# EAGLE design RGBIO8 (EAGLE 5.11)
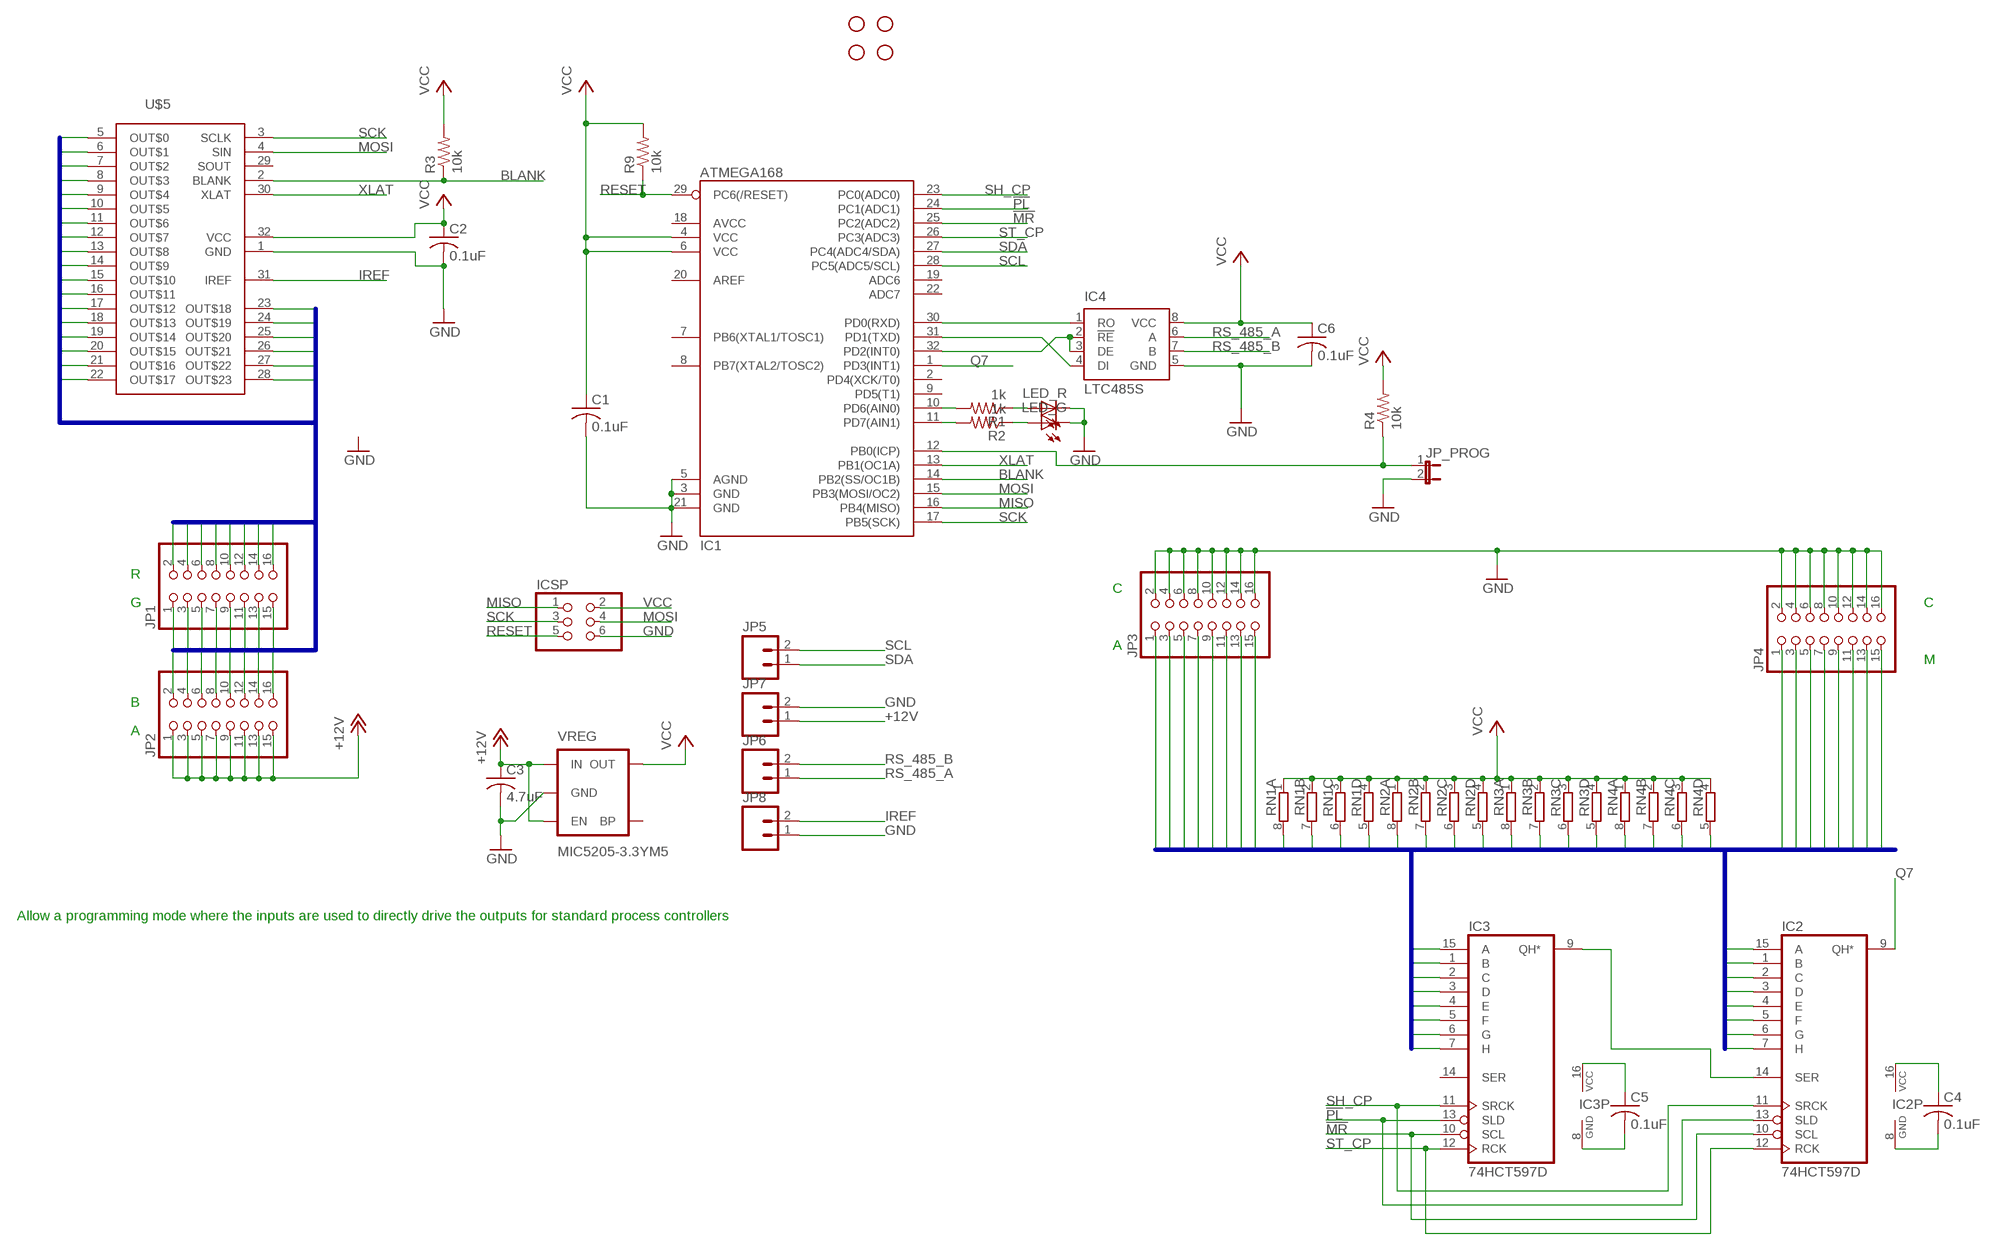
[diagram p0: schematic, sheet 1]

## Parts
C1  0.1uF  C-USC0603  [C0603]
C2  0.1uF  C-USC0603  [C0603]
C3  4.7uF  C-USC0603  [C0603]
C4  0.1uF  C-USC0603  [C0603]
C5  0.1uF  C-USC0603  [C0603]
C6  0.1uF  C-USC0603  [C0603]
IC1  ATMEGA168  [TQFP32-08]
IC2  74HCT597D  [SO16]
IC3  74HCT597D  [SO16]
IC4  LTC485S  [SOIC8]
ICSP  PINHD-2X3  [2X03]
JP1  PINHD-2X8  [2X08]
JP2  PINHD-2X8  [2X08]
JP3  PINHD-2X8  [2X08]
JP4  PINHD-2X8  [2X08]
JP5  M023.5MM  [SCREWTERMINAL-3.5MM-2]
JP6  M023.5MM  [SCREWTERMINAL-3.5MM-2]
JP7  M023.5MM  [SCREWTERMINAL-3.5MM-2]
JP8  M023.5MM  [SCREWTERMINAL-3.5MM-2]
JP_PROG  JUMPER-2PTH  [1X02]
LED_G  LEDCHIP-LED0603  [CHIP-LED0603]
LED_R  LEDCHIP-LED0603  [CHIP-LED0603]
R1  1k  R-US_R0603  [R0603]
R2  1k  R-US_R0603  [R0603]
R3  10k  R-US_R0603  [R0603]
R4  10k  R-US_R0603  [R0603]
R9  10k  R-US_R0603  [R0603]
RN1  4R-NEXBS8V  [EXBS8V]
RN2  4R-NEXBS8V  [EXBS8V]
RN3  4R-NEXBS8V  [EXBS8V]
RN4  4R-NEXBS8V  [EXBS8V]
U$1  STAND-OFF  [STAND-OFF]
U$2  STAND-OFF  [STAND-OFF]
U$3  STAND-OFF  [STAND-OFF]
U$4  STAND-OFF  [STAND-OFF]
U$5  TLC5947  [HTSSOP32DAP]
VREG  MIC5205-3.3YM5  V_REG_LDOSMD  [SOT23-5]

## Nets
!MR: IC1.25(PC2(ADC2)) IC2.10(SCL) IC3.10(SCL)
!PL: IC1.24(PC1(ADC1)) IC2.13(SLD) IC3.13(SLD)
+12V [Power]: C3.1 JP2.1 JP2.3 JP2.5 JP2.7 JP2.9 JP2.11 JP2.13 JP2.15 JP7.1 VREG.1(IN) VREG.3(EN)
BLANK: IC1.14(PB2(SS/OC1B)) R3.1 U$5.2(BLANK)
GND [Power]: C1.2 C2.2 C3.2 C4.2 C5.2 C6.2 IC1.3(GND) IC1.5(AGND) IC1.21(GND) IC2.8(GND) IC3.8(GND) IC4.5(GND) ICSP.6 JP3.2 JP3.4 JP3.6 JP3.8 JP3.10 JP3.12 JP3.14 JP3.16 JP4.2 JP4.4 JP4.6 JP4.8 JP4.10 JP4.12 JP4.14 JP4.16 JP7.2 JP8.1 JP_PROG.2 LED_G.C LED_R.C U$5.1(GND) VREG.2(GND)
INPUT0: IC2.7(H) JP4.1 RN1.8
INPUT1: IC2.6(G) JP3.1 RN1.7
INPUT2: IC2.5(F) JP4.3 RN1.6
INPUT3: IC2.4(E) JP3.3 RN1.5
INPUT4: IC2.3(D) JP4.5 RN2.8
INPUT5: IC2.2(C) JP3.5 RN2.7
INPUT6: IC2.1(B) JP4.7 RN2.6
INPUT7: IC2.15(A) JP3.7 RN2.5
INPUT8: IC3.7(H) JP4.9 RN3.8
INPUT9: IC3.6(G) JP3.9 RN3.7
INPUT10: IC3.5(F) JP4.11 RN3.6
INPUT11: IC3.4(E) JP3.11 RN3.5
INPUT12: IC3.3(D) JP4.13 RN4.8
INPUT13: IC3.2(C) JP3.13 RN4.7
INPUT14: IC3.1(B) JP4.15 RN4.6
INPUT15: IC3.15(A) JP3.15 RN4.5
IREF: JP8.2 U$5.31(IREF)
MISO: IC1.16(PB4(MISO)) ICSP.1
MOSI: IC1.15(PB3(MOSI/OC2)) ICSP.4 U$5.4(SIN)
N$1: IC1.10(PD6(AIN0)) R1.2
N$2: LED_R.A R1.1
N$3: IC1.11(PD7(AIN1)) R2.2
N$4: LED_G.A R2.1
N$5: IC1.32(PD2(INT0)) IC4.2(!RE) IC4.3(DE)
N$6: IC1.12(PB0(ICP)) JP_PROG.1 R4.1
N$21: IC2.14(SER) IC3.9(QH*)
N$43: IC1.31(PD1(TXD)) IC4.4(DI)
N$44: IC1.30(PD0(RXD)) IC4.1(RO)
OUT0: JP1.2 U$5.5(OUT$0)
OUT1: JP1.1 U$5.6(OUT$1)
OUT2: JP2.2 U$5.7(OUT$2)
OUT3: JP1.4 U$5.8(OUT$3)
OUT4: JP1.3 U$5.9(OUT$4)
OUT5: JP2.4 U$5.10(OUT$5)
OUT6: JP1.6 U$5.11(OUT$6)
OUT7: JP1.5 U$5.12(OUT$7)
OUT8: JP2.6 U$5.13(OUT$8)
OUT9: JP1.8 U$5.14(OUT$9)
OUT10: JP1.7 U$5.15(OUT$10)
OUT11: JP2.8 U$5.16(OUT$11)
OUT12: JP1.10 U$5.17(OUT$12)
OUT13: JP1.9 U$5.18(OUT$13)
OUT14: JP2.10 U$5.19(OUT$14)
OUT15: JP1.12 U$5.20(OUT$15)
OUT16: JP1.11 U$5.21(OUT$16)
OUT17: JP2.12 U$5.22(OUT$17)
OUT18: JP1.14 U$5.23(OUT$18)
OUT19: JP1.13 U$5.24(OUT$19)
OUT20: JP2.14 U$5.25(OUT$20)
OUT21: JP1.16 U$5.26(OUT$21)
OUT22: JP1.15 U$5.27(OUT$22)
OUT23: JP2.16 U$5.28(OUT$23)
Q7: IC1.1(PD3(INT1)) IC2.9(QH*)
RESET: IC1.29(PC6(/RESET)) ICSP.5 R9.1
RS_485_A: IC4.6(A) JP6.1
RS_485_B: IC4.7(B) JP6.2
SCK: IC1.17(PB5(SCK)) ICSP.3 U$5.3(SCLK)
SCL: IC1.28(PC5(ADC5/SCL)) JP5.2
SDA: IC1.27(PC4(ADC4/SDA)) JP5.1
SH_CP: IC1.23(PC0(ADC0)) IC2.11(SRCK) IC3.11(SRCK)
ST_CP: IC1.26(PC3(ADC3)) IC2.12(RCK) IC3.12(RCK)
VCC [Power]: C1.1 C2.1 C4.1 C5.1 C6.1 IC1.4(VCC) IC1.6(VCC) IC2.16(VCC) IC3.16(VCC) IC4.8(VCC) ICSP.2 R3.2 R4.2 R9.2 RN1.1 RN1.2 RN1.3 RN1.4 RN2.1 RN2.2 RN2.3 RN2.4 RN3.1 RN3.2 RN3.3 RN3.4 RN4.1 RN4.2 RN4.3 RN4.4 U$5.32(VCC) VREG.5(OUT)
XLAT: IC1.13(PB1(OC1A)) U$5.30(XLAT)
Unconnected: IC1.2(PD4(XCK/T0)) IC1.7(PB6(XTAL1/TOSC1)) IC1.8(PB7(XTAL2/TOSC2)) IC1.9(PD5(T1)) IC1.18(AVCC) IC1.19(ADC6) IC1.20(AREF) IC1.22(ADC7) IC3.14(SER) U$5.29(SOUT) VREG.4(BP)

## Buses
OUT[0..23]
INPUT[0..15]

## Notes on the sheet
- R
- C
- G | C
- A
- M
- B
- A
- Allow a programming mode where the inputs are used to directly drive the outputs for standard process controllers

## Library data of the parts
C1-C6 = rcl:C-US: CAPACITOR, American symbol
IC1 = SparkFun:ATMEGA168
IC2 IC3 = 74xx-eu:74*597: 8-bit SHIFT REGISTER, input latch
IC4 = linear-technology:LTC485: Low Power RS485 Interface Transceiver Source: http://www.linear.com/pc/downloadDocument.do?navId=H0,C1,C1007,C1017,P2064,D1718; OC_FARNELL: unknown; OC_NEWARK: unknown
ICSP = JVN:PINHD-2X3: PIN HEADER
JP1-JP4 = pinhead:PINHD-2X8: PIN HEADER
JP5-JP8 = SparkFun:M02: Header 2 Standard 2-pin 0.1" header. Use with straight break away headers (SKU : PRT-00116), right angle break away headers (PRT-00553), swiss pins (PRT-00743), machine pins (PRT-00117), and female headers (PRT-00115). Molex polarized connector foot print use with SKU : PRT-08233 with associated crimp pins and housings.
JP_PROG = SparkFun:JUMPER-2: Jumper Basic 0.1" spaced jumper. Use with breakaway headers.
LED_G LED_R = led:LED: LED OSRAM: - CHIPLED LG R971, LG N971, LY N971, LG Q971, LY Q971, LO R971, LY R971 LH N974, LH R974 LS Q976, LO Q976, LY Q976 LO Q996 - Hyper CHIPLED LW Q18S LB Q993, LB Q99A, LB R99A - SideLED LS A670, LO A670, LY A670, LG A670, LP A670 LB A673, LV A673, LT A673, LW A673 LH A674 LY A675 LS A676, LA A676, LO A676, LY A676, LW A676 LS A679, LY A679, LG A679 - Hyper Micro SIDELED® LS Y876, LA Y876, LO Y876, LY Y876 LT Y87S - SmartLED LW L88C, LW L88S LB L89C, LB L89S, LG L890 LS L89K, LO L89K, LY L89K LS L896, LA L896, LO L896, LY L896 - TOPLED LS T670, LO T670, LY T670, LG T670, LP T670 LSG T670, LSP T670, LSY T670, LOP T670, LYG T670 LG T671, LOG T671, LSG T671 LB T673, LV T673, LT T673, LW T673 LH T674 LS T676, LA T676, LO T676, LY T676, LB T676, LH T676, LSB T676, LW T676 LB T67C, LV T67C, LT T67C, LS T67K, LO T67K, LY T67K, LW E67C LS E67B, LA E67B, LO E67B, LY E67B, LB E67C, LV E67C, LT E67C LW T67C LS T679, LY T679, LG T679 LS T770, LO T770, LY T770, LG T770, LP T770 LB T773, LV T773, LT T773, LW T773 LH T774 LS E675, LA E675, LY E675, LS T675 LS T776, LA T776, LO T776, LY T776, LB T776 LHGB T686 LT T68C, LB T68C - Hyper Mini TOPLED® LB M676 - Mini TOPLED Santana® LG M470 LS M47K, LO M47K, LY M47K Source: http://www.osram.convergy.de LUXEON: - LUMILED® LXK2-PW12-R00, LXK2-PW12-S00, LXK2-PW14-U00, LXK2-PW14-V00 LXK2-PM12-R00, LXK2-PM12-S00, LXK2-PM14-U00 LXK2-PE12-Q00, LXK2-PE12-R00, LXK2-PE12-S00, LXK2-PE14-T00, LXK2-PE14-U00 LXK2-PB12-K00, LXK2-PB12-L00, LXK2-PB12-M00, LXK2-PB14-N00, LXK2-PB14-P00, LXK2-PB14-Q00 LXK2-PR12-L00, LXK2-PR12-M00, LXK2-PR14-Q00, LXK2-PR14-R00 LXK2-PD12-Q00, LXK2-PD12-R00, LXK2-PD12-S00 LXK2-PH12-R00, LXK2-PH12-S00 LXK2-PL12-P00, LXK2-PL12-Q00, LXK2-PL12-R00 Source: www.luxeon.com KINGBRIGHT: KA-3528ASYC Source: www.kingbright.com
R1-R4 R9 = rcl:R-US_: RESISTOR, American symbol
RN1-RN4 = resistor-dil:4R-N: Array Chip Resistor Source: RS Component / Phycomp; OC_FARNELL: unknown; OC_NEWARK: unknown
U$1-U$4 = SparkFun:STAND-OFF: Stand Off This is the mechanical footprint for a #4 phillips button head screw. Use the keepout ring to avoid running the screw head into surrounding components. SKU : PRT-00447
U$5 = JVN:TLC5947
VREG = SparkFun:V_REG_LDO: Voltage Regulator LDO Standard 150mA LDO voltage regulator in SOT-23 layout. Micrel part MIC5205. BP (by-pass) pin is used to lower output noise with 470pF cap.

## Net classes
1 Power: width 0.406 mm, clearance 0.203 mm

## Board
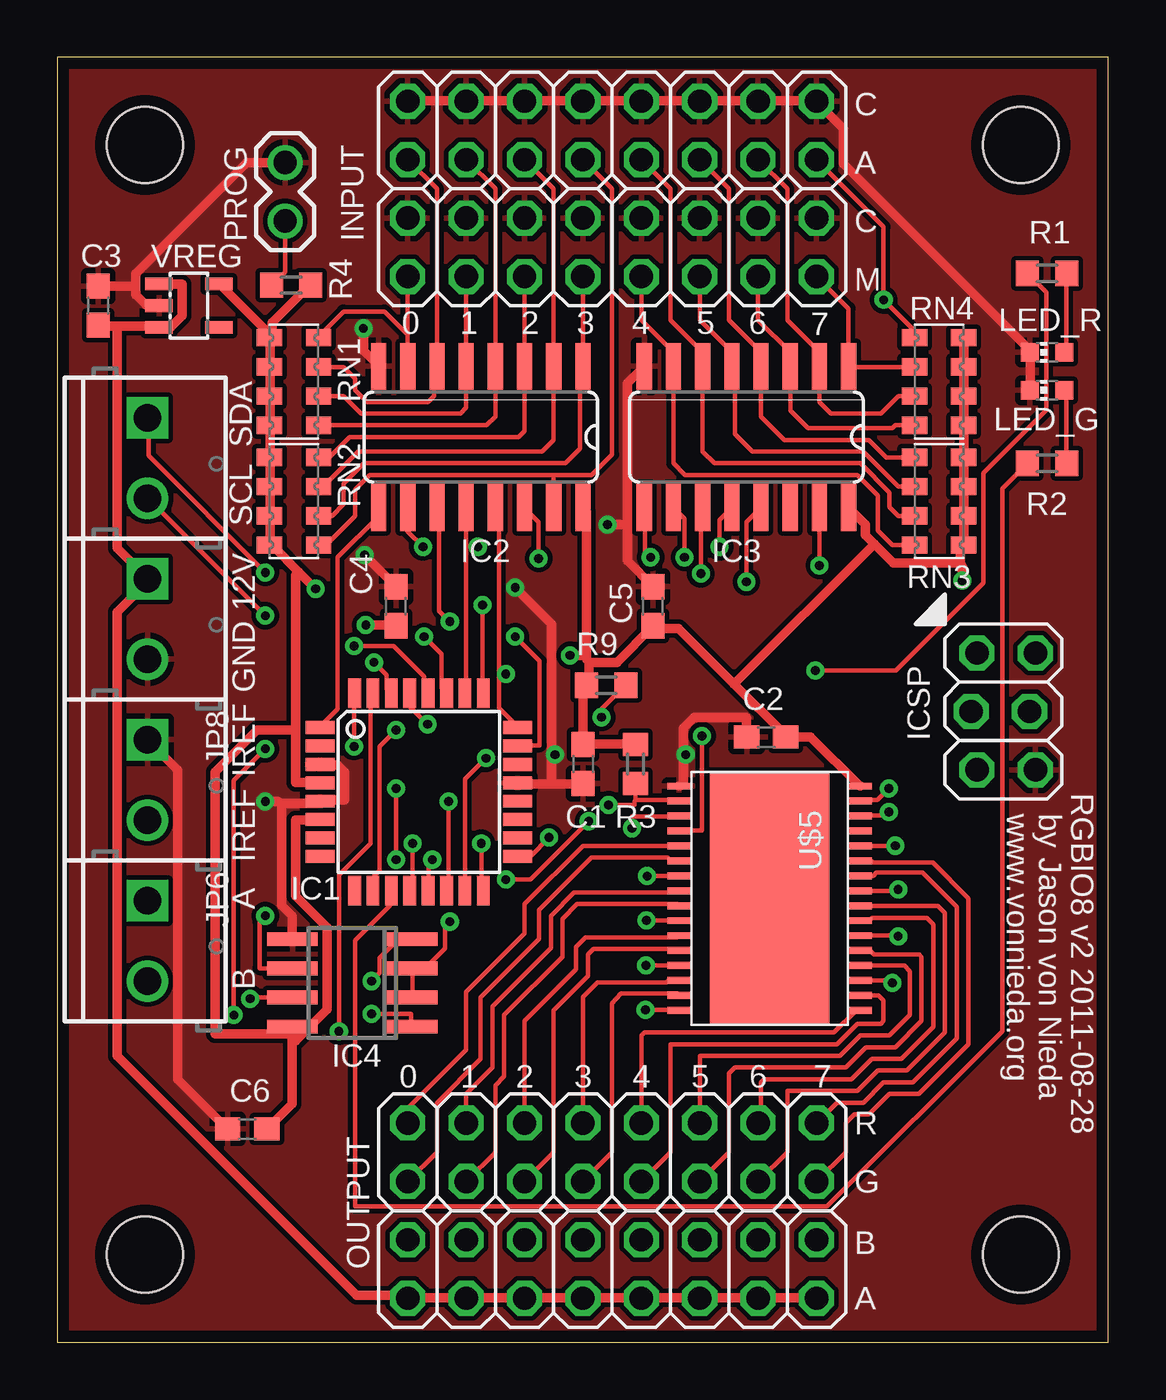
[diagram p1: board, top side]
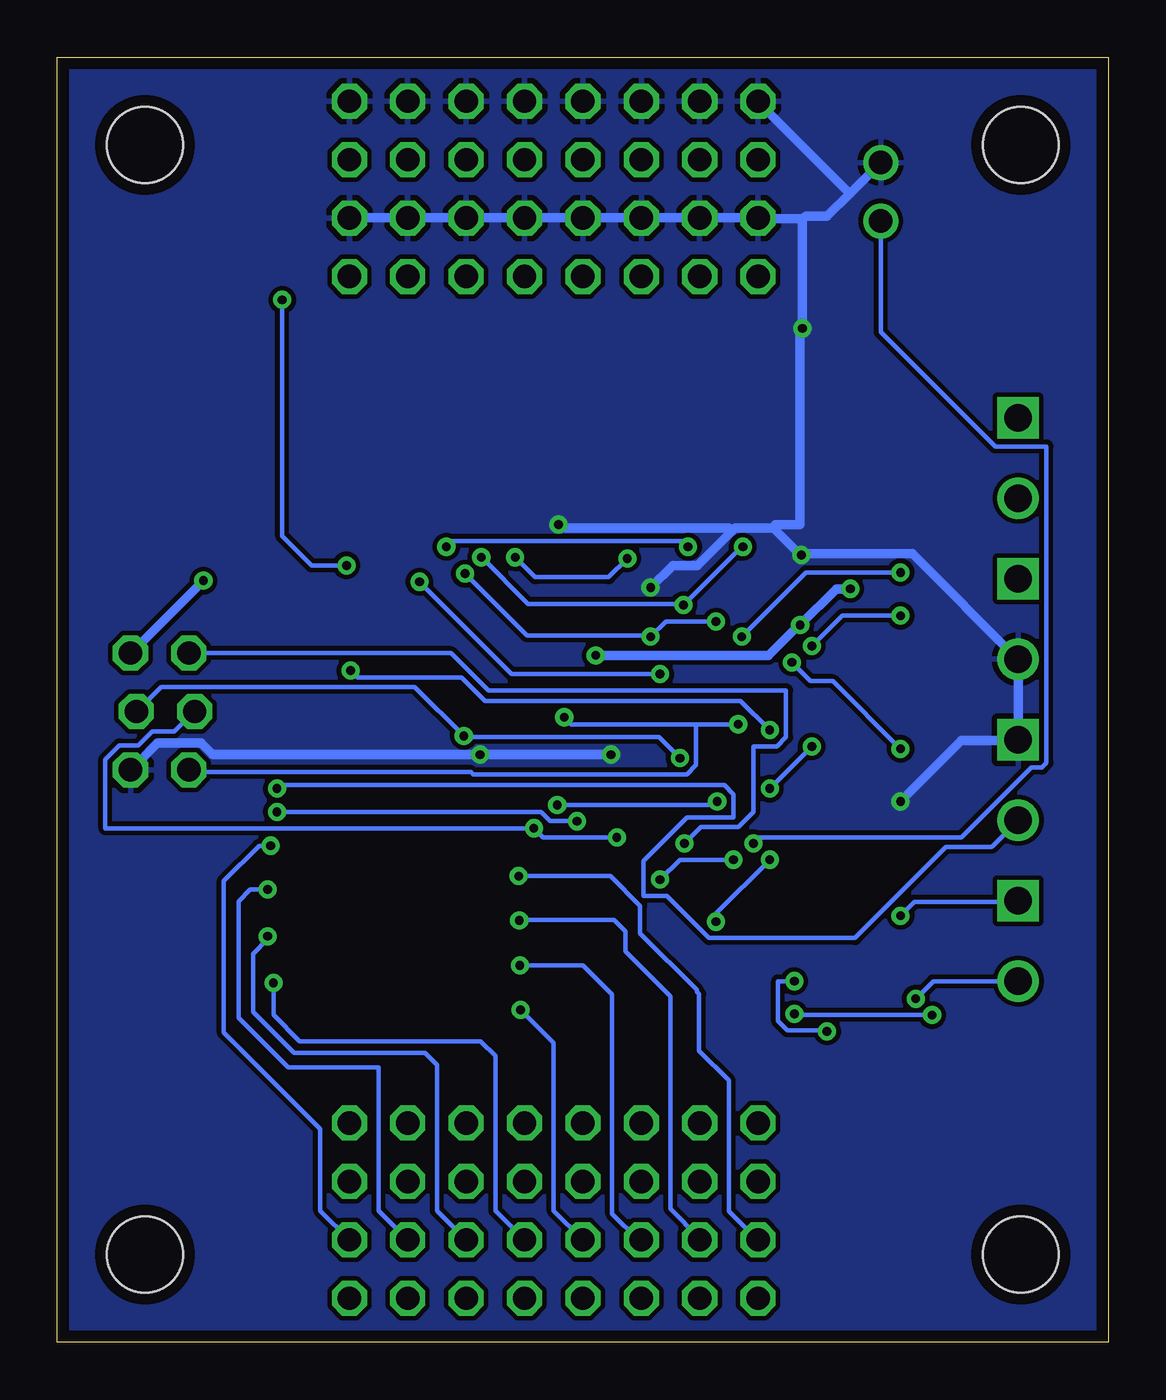
[diagram p2: board, bottom side, seen from below]

Size 45.72 x 55.88 mm. Coordinates in mm from the lower left corner, seen from the top.
Outline: 0,0 45.72,0 45.72,55.88 0,55.88 0,0
Copper layers (1*16): Top 0.035mm / dielectric 1.5mm / Bottom 0.035mm
Design rules "GoldPhoenix *": minimum track width 8mil, minimum drill 15mil, track to track 8mil, track to pad 8mil, pad to pad 8mil, via to via 8mil, smd to smd 8mil, copper to edge 20mil, drill to drill 10mil, minimum pad ring 10mil, minimum via ring 8mil, stop-mask expansion 4mil, vias tented up to drill 24mil, thermal gap 10mil
vRestrict: area 12.4,3.2 to 13.6,8.5; area 14.9,11 to 33.7,12.1; area 34.7,1.4 to 35.4,10; area 34.7,45.7 to 35.4,54.4; area 12.3,47.9 to 13.3,51.9; area 14.9,43.8 to 33.5,44.8; area 7.5,15.4 to 8.6,41.5; area 37.2,31.1 to 38.7,32.6; area 36.8,26.2 to 38,29.3; area 40.8,39.5 to 45.1,40.6; area 40.8,43.8 to 45.3,45.1; area 7.2,47.9 to 8.3,51.9

### Footprints (pad centres in the part's own frame; a part is rotated, then mirrored left to right if it is on the bottom)
C0603 = smd 1.1 x 1: 1 -0.85,0; 2 0.85,0
TQFP32-08 = smd 1.27 x 0.559: 1 -4.293,2.8; 2 -4.293,2; 3 -4.293,1.2; 4 -4.293,0.4; 5 -4.293,-0.4; 6 -4.293,-1.2; 7 -4.293,-2; 8 -4.293,-2.8; 17 4.293,-2.8; 18 4.293,-2; 19 4.293,-1.2; 20 4.293,-0.4; 21 4.293,0.4; 22 4.293,1.2; 23 4.293,2; 24 4.293,2.8 | smd 0.559 x 1.27: 9 -2.8,-4.293; 10 -2,-4.293; 11 -1.2,-4.293; 12 -0.4,-4.293; 13 0.4,-4.293; 14 1.2,-4.293; 15 2,-4.293; 16 2.8,-4.293; 25 2.8,4.293; 26 2,4.293; 27 1.2,4.293; 28 0.4,4.293; 29 -0.4,4.293; 30 -1.2,4.293; 31 -2,4.293; 32 -2.8,4.293
SO16 = smd 0.66 x 2.032: 1 -4.445,-3.073; 2 -3.175,-3.073; 3 -1.905,-3.073; 4 -0.635,-3.073; 5 0.635,-3.073; 6 1.905,-3.073; 7 3.175,-3.073; 8 4.445,-3.073; 9 4.445,3.073; 10 3.175,3.073; 11 1.905,3.073; 12 0.635,3.073; 13 -0.635,3.073; 14 -1.905,3.073; 15 -3.175,3.073; 16 -4.445,3.073
SOIC8 = smd 0.6 x 2.2: 1 -1.905,-2.6; 2 -0.635,-2.6; 3 0.635,-2.6; 4 1.905,-2.6; 5 1.905,2.6; 6 0.635,2.6; 7 -0.635,2.6; 8 -1.905,2.6
2X03 = drill 1.016 octagon: 1 -2.54,-1.143; 2 -2.54,1.397; 3 0,-1.397; 4 0,1.143; 5 2.54,-1.143; 6 2.54,1.397
2X08 = drill 1.016 octagon: 1 -8.89,-1.27; 2 -8.89,1.27; 3 -6.35,-1.27; 4 -6.35,1.27; 5 -3.81,-1.27; 6 -3.81,1.27; 7 -1.27,-1.27; 8 -1.27,1.27; 9 1.27,-1.27; 10 1.27,1.27; 11 3.81,-1.27; 12 3.81,1.27; 13 6.35,-1.27; 14 6.35,1.27; 15 8.89,-1.27; 16 8.89,1.27
SCREWTERMINAL-3.5MM-2 = drill 1.2 square: 1 0,0 | drill 1.2 round: 2 3.5,0
1X02 = drill 1.016 round: 1 0,0; 2 2.54,0
CHIP-LED0603 = smd 0.8 x 0.8: A 0,-0.75; C 0,0.75
R0603 = smd 1 x 1.1: 1 -0.85,0; 2 0.85,0
EXBS8V = smd 0.75 x 1.1: 1 -1.905,-1.07; 2 -0.635,-1.07; 3 0.635,-1.07; 4 1.905,-1.07; 5 1.905,1.07; 6 0.635,1.07; 7 -0.635,1.07; 8 -1.905,1.07
STAND-OFF = hole 3.302: 0,0
HTSSOP32DAP = smd 0.3 x 1: 1 -4.875,-3.95; 2 -4.225,-3.95; 3 -3.575,-3.95; 4 -2.925,-3.95; 5 -2.275,-3.95; 6 -1.625,-3.95; 7 -0.975,-3.95; 8 -0.325,-3.95; 9 0.325,-3.95; 10 0.975,-3.95; 11 1.625,-3.95; 12 2.275,-3.95; 13 2.925,-3.95; 14 3.575,-3.95; 15 4.225,-3.95; 16 4.875,-3.95; 17 4.875,3.95; 18 4.225,3.95; 19 3.575,3.95; 20 2.925,3.95; 21 2.275,3.95; 22 1.625,3.95; 23 0.975,3.95; 24 0.325,3.95; 25 -0.325,3.95; 26 -0.975,3.95; 27 -1.625,3.95; 28 -2.275,3.95; 29 -2.925,3.95; 30 -3.575,3.95; 31 -4.225,3.95; 32 -4.875,3.95 | smd 11 x 5.2: EXP 0,0
SOT23-5 = smd 0.55 x 1.2: 1 -0.95,-1.3; 2 0,-1.3; 3 0.95,-1.3; 4 0.95,1.3; 5 -0.95,1.3

### Placement (x,y rotation side)
C1  22.86,25.15 270 top
C2  30.84,26.31 180 top
C3  1.78,45.09 90 top
C4  14.73,32 90 top
C5  25.91,32 90 top
C6  8.26,9.27 180 top
IC1  15.72,23.93 0 top
IC2  18.41,39.37 180 top
IC3  29.97,39.37 180 top
IC4  12.83,15.62 90 top
ICSP  41.15,27.43 270 top
JP1  24.13,8.26 0 top
JP2  24.13,3.17 0 top
JP3  24.13,52.7 0 top
JP4  24.13,47.62 0 top
JP5  3.92,40.2 270 top
JP6  3.92,19.2 270 top
JP7  3.92,33.2 270 top
JP8  3.92,26.2 270 top
JP_PROG  9.91,48.77 90 top
LED_G  43.05,41.4 90 top
LED_R  43.05,43.05 90 top
R1  43.05,46.48 180 top
R2  43.05,38.23 180 top
R3  25.15,25.15 90 top
R4  10.16,45.97 0 top
R9  23.88,28.57 180 top
RN1  10.29,41.78 270 top
RN2  10.29,36.58 270 top
RN3  38.35,36.58 90 top
RN4  38.35,41.78 90 top
U$1  41.91,3.81 0 top
U$2  3.81,3.81 0 top
U$3  3.81,52.07 0 top
U$4  41.91,52.07 0 top
U$5  30.99,19.3 270 top
VREG  5.71,45.09 270 top

### Tracks (layer width: path | path; a pad name or v marks a point on that pad's centre or on a via)
!MR  (via drill 0.38)
  Top 0.203: v18.49,32.05 18.49,28.25 IC1.25 | v15.9,34.59 15.24,35.26 IC2.10 | v27.28,34.14 27.28,35.81 IC3.10
  Bottom 0.203: v15.9,34.59 15.95,34.59 v18.49,32.05 18.54,32.11 25.25,32.11 v27.28,34.14
!PL  (via drill 0.38)
  Top 0.203: 19.2,29.06 19.2,36.12 19.05,36.27 IC2.13 | 19.2,29.06 19.2,27.58 20.02,26.77 IC1.24 | v29.97,33.07 29.97,35.66 IC3.13 | 19.2,29.06 v19.51,29.06
  Bottom 0.203: v29.97,33.07 25.96,29.06 v19.51,29.06
+12V
  Top 0.406: 2.59,44.2 4.37,44.2 4.37,44.15 VREG.3 4.62,44.15 4.93,44.15 5.44,44.65 5.44,46.02 4.42,46.02 VREG.1 | 2.59,44.2 1.78,44.2 C3.1 | 2.59,44.2 2.59,34.54 3.91,33.22 JP7.1 3.86,33.02 2.59,31.75 2.59,12.45 13.01,2.03 15.09,2.03 JP2.1 15.24,1.93 17.78,1.93 JP2.3 17.93,1.93 20.32,1.93 JP2.5 20.47,1.93 22.86,1.93 JP2.7 23.01,1.93 25.4,1.93 JP2.9 25.55,1.93 27.94,1.93 JP2.11 28.09,1.93 30.48,1.93 JP2.13 30.63,1.93 33.02,1.93 JP2.15
BLANK  (via drill 0.38)
  Top 0.203: 25.15,23.57 27.03,23.57 U$5.2 | 25.15,23.57 R3.1 | v17.02,23.52 17.02,19.71 16.97,19.66 IC1.14 | v23.98,23.37 25.09,23.37 25.09,23.52 25.15,23.57
  Bottom 0.203: v17.02,23.52 17.17,23.37 v23.98,23.37
GND  (via drill 0.38)
  Top 0.406: JP3.2 15.24,54 17.78,54 JP3.4 17.93,54 20.32,54 JP3.6 20.47,54 22.86,54 JP3.8 23.01,54 25.4,54 JP3.10 25.55,54 27.94,54 JP3.12 28.09,54 30.48,54 JP3.14 30.63,54 32.87,54 JP3.16 33.02,53.95 34.19,52.78 34.19,51.26 42.22,43.23 LED_R.C 42.32,43.03 42.32,41.4 LED_G.C | 3.4,45.92 1.78,45.92 C3.2 | 3.4,45.92 3.4,45.57 3.86,45.11 4.37,45.11 VREG.2 | JP_PROG.2 8.23,51.31 3.4,46.48 3.4,45.92 | v13.31,44.09 13.31,43.13 13.97,42.47 IC2.8 | IC1.3 11.43,25.09 12.19,25.09 12.5,24.79 12.5,23.57 11.43,23.57 IC1.5 11.28,23.42 9.75,23.42 | 9.75,23.42 9.75,19 10.21,18.54 10.21,17.53 IC4.5 | C6.2 7.37,9.3 5.23,11.43 5.23,24.89 3.96,26.16 JP8.1 | v9.04,23.52 9.6,23.52 9.75,23.42 | 27.23,25.55 27.23,26.72 27.69,27.18 29.97,27.18 29.97,26.31 C2.2 | 27.23,25.55 27.23,24.33 27.08,24.18 U$5.1 | v27.33,25.55 27.23,25.55 | 24.79,35.56 24.79,41.71 IC3.8 | 24.79,35.56 24.79,33.98 25.91,32.87 C5.2 | 21.49,24.28 20.02,24.28 IC1.21 | 21.49,24.28 22.86,24.28 C1.2 | v13.36,34.24 14.73,32.87 C4.2 | 21.49,25.55 21.49,31.24 v19.91,32.82 | 21.49,25.55 21.49,24.28 | v23.93,35.56 24.79,35.56 | 21.49,25.55 v21.64,25.55
  Bottom 0.406: 13.31,48.87 v13.31,44.09 13.41,43.94 13.41,35.56 14.48,35.56 14.58,35.41 | 13.31,48.87 15.24,48.87 JP4.2 15.39,48.92 17.78,48.92 JP4.4 17.93,48.92 20.32,48.92 JP4.6 20.47,48.92 22.86,48.92 JP4.8 23.01,48.92 25.4,48.92 JP4.10 25.55,48.92 27.94,48.92 JP4.12 28.09,48.92 30.48,48.92 JP4.14 30.63,48.92 33.02,48.92 JP4.16 | 11.25,49.96 12.24,48.97 13.16,48.97 13.31,48.87 | 11.25,49.96 JP_PROG.2 | JP3.2 15.24,53.95 11.25,49.96 | v9.04,23.52 6.4,26.16 3.96,26.16 JP8.1 3.91,26.36 3.91,29.52 JP7.2 3.96,29.72 8.53,34.29 13.31,34.29 v13.36,34.24 13.51,34.34 14.58,35.41 | ICSP.6 42.52,24.89 41.35,26.06 39.47,26.06 38.96,25.55 v27.33,25.55 v21.64,25.55 | v19.91,32.82 18.95,33.78 17.88,33.78 16.38,35.28 | 16.38,35.28 16.26,35.41 14.58,35.41 | v23.93,35.56 23.77,35.41 16.51,35.41 16.38,35.28
  pour Bottom: 0,55.88 45.72,55.88 45.72,0 0,0
  pour Top: 0,55.88 45.72,55.88 45.72,0 0,0
INPUT0
  Top 0.203: 15.24,43.81 JP4.1 14.86,46.74 | 15.24,43.81 IC2.7 | 15.24,43.81 14.22,44.83 12.45,44.83 11.36,43.74 RN1.8
INPUT1
  Top 0.203: JP3.1 16.51,50.16 IC2.6 16.38,42.32 16.38,41.15 16.13,40.89 13.46,40.89 12.95,41.4 12.95,41.91 12.45,42.42 RN1.7
INPUT2
  Top 0.203: JP4.3 IC2.5 17.78,40.64 17.53,40.39 13.21,40.39 12.45,41.15 RN1.6
INPUT3
  Top 0.203: JP3.3 19.05,50.16 IC2.4 19.05,40.26 18.67,39.88 RN1.5
INPUT4
  Top 0.203: JP4.5 IC2.3 20.32,39.62 20.07,39.37 12.7,39.37 11.81,38.48 RN2.8
INPUT5
  Top 0.203: JP3.5 21.59,50.16 IC2.2 21.59,39.24 21.08,38.73 13.08,38.73 11.56,37.21 RN2.7
INPUT6
  Top 0.203: JP4.7 IC2.1 22.73,42.32 22.73,38.86 22.1,38.23 13.34,38.23 12.45,37.34 12.45,36.45 11.94,35.94 RN2.6
INPUT7
  Top 0.203: 21.59,37.72 IC2.15 | 21.59,37.72 13.59,37.72 12.95,37.08 12.95,35.94 11.68,34.67 RN2.5 | JP3.7 24.13,50.16 24.13,38.61 23.24,37.72 21.59,37.72
INPUT8
  Top 0.203: JP4.9 25.4,44.45 26.8,43.05 IC3.7 26.8,38.23 27.3,37.72 34.8,37.72 35.69,36.83 35.69,35.31 36.32,34.67 RN3.8
INPUT9
  Top 0.203: IC3.6 27.94,42.32 | JP3.9 26.67,50.16 26.67,44.45 28.07,43.05 IC3.6 | RN3.7 36.58,35.94 36.2,36.32 36.2,36.96 34.92,38.23 28.57,38.23 28.07,38.73 IC3.6
INPUT10
  Top 0.203: IC3.5 29.21,42.32 | JP4.11 27.94,44.45 29.34,43.05 IC3.5 | RN3.6 36.58,37.21 35.05,38.73 30.23,38.73 29.46,39.5 29.46,42.32 IC3.5
INPUT11
  Top 0.203: IC3.4 30.48,42.32 | JP3.11 29.21,50.16 29.21,44.45 30.61,43.05 IC3.4 | RN3.5 36.07,38.48 35.31,39.24 31.62,39.24 30.61,40.26 IC3.4
INPUT12
  Top 0.203: JP4.13 30.48,44.45 31.88,43.05 IC3.3 31.88,40.51 32.64,39.75 36.32,39.75 36.45,39.88 RN4.8
INPUT13
  Top 0.203: JP3.13 31.75,50.16 31.75,44.45 33.15,43.05 IC3.2 33.15,40.89 33.66,40.39 35.81,40.39 36.58,41.15 RN4.7
INPUT14
  Top 0.203: JP4.15 34.42,44.96 IC3.1 34.44,42.42 RN4.6
INPUT15  (via drill 0.38)
  Top 0.203: v33.15,33.78 IC3.15 | RN4.5 37.28,44 v35.94,45.34 35.94,48.51 JP3.15
  Bottom 0.203: v35.94,45.34 35.94,35.05 34.67,33.78 v33.15,33.78
IREF  (via drill 0.38)
  Top 0.203: v36.17,24.08 35.66,23.57 34.95,23.57 U$5.31
  Bottom 0.203: v36.17,24.08 36.02,24.23 16.71,24.23 16.31,23.82 16.31,22.81 18.34,22.81 20.22,20.93 20.22,19.41 19.2,19.41 17.37,17.58 11.02,17.58 7.06,21.54 5.08,21.54 3.96,22.66 JP8.2
MISO  (via drill 0.38)
  Top 0.203: v18.44,21.69 18.44,19.71 18.49,19.66 IC1.16
  Bottom 0.203: v18.44,21.69 17.73,22.4 16.1,22.4 15.44,23.06 15.44,25.91 14.43,25.91 14.02,26.31 14.02,28.35 26.98,28.35 28.6,29.97 ICSP.1
MOSI  (via drill 0.38)
  Top 0.203: v28.04,26.36 28.04,22.25 27.08,22.25 U$5.4 | v18.64,25.4 17.73,24.49 17.73,19.66 IC1.15
  Bottom 0.203: ICSP.4 42.27,27.43 41.2,28.5 30.18,28.5 v28.04,26.36 27.99,26.31 19.56,26.31 v18.64,25.4
N$1  (via drill 0.38)
  Top 0.203: v32.97,29.21 36.47,29.21 40.28,33.02 40.28,37.8 43.03,40.54 43.03,45.67 42.22,46.48 R1.2 | v14.73,26.62 14.02,25.91 14.02,20.52 13.77,20.27 13.77,19.66 IC1.10
  Bottom 0.203: v32.97,29.21 32.66,28.91 28.14,28.91 27.13,27.89 16,27.89 v14.73,26.62
N$2
  Top 0.203: LED_R.A 43.84,43.08 43.89,43.13 R1.1
N$3
  Top 0.203: R2.2 42.16,38.2 41.1,37.13 41.1,13.51 33.48,5.89 12.95,5.89 12.95,17.48 14.48,19 14.48,19.61 IC1.11
N$4
  Top 0.203: LED_G.A 43.84,41.4 43.89,41.35 43.89,38.25 R2.1
N$5  (via drill 0.38)
  Top 0.203: v12.9,25.91 12.9,28.19 IC1.32 | v14.73,20.98 v14.73,24.08 | v17.07,18.29 16.87,18.09 16.87,17.12 16,16.26 IC4.3 15.44,16.2 15.44,14.99 IC4.2
  Bottom 0.203: v14.73,24.08 v12.9,25.91 | v14.73,20.98 17.07,18.64 v17.07,18.29
N$6  (via drill 0.38)
  Top 0.203: JP_PROG.1 9.91,46.53 9.35,45.97 R4.1 | v15.44,21.69 15.44,19.76 15.34,19.66 IC1.12
  Bottom 0.203: v15.44,21.69 15.19,21.95 6.4,21.95 3.35,24.99 2.9,24.99 2.69,25.2 2.69,38.96 4.93,38.96 9.91,43.94 JP_PROG.1
N$21  (via drill 0.38)
  Top 0.203: v20.93,34.09 20.93,35.66 20.32,36.27 IC2.14 | v25.81,34.14 25.55,34.39 25.55,36.27 IC3.9
  Bottom 0.203: v20.93,34.09 21.74,33.27 24.94,33.27 v25.81,34.14
N$43  (via drill 0.38)
  Top 0.203: v12.24,13.51 12.24,20.32 13.61,21.69 13.61,28.09 13.72,28.19 IC1.31 | v13.66,15.7 14.02,16.05 14.02,16.71 14.83,17.53 IC4.4
  Bottom 0.203: v12.24,13.51 12.29,13.56 13.97,13.56 14.38,13.97 14.38,15.7 v13.66,15.7
N$44  (via drill 0.38)
  Top 0.203: v13.77,29.57 14.33,29.01 14.33,28.4 14.48,28.25 IC1.30 | v9.04,25.81 7.67,24.43 v7.67,14.22 | v13.66,14.28 15.39,14.28 15.39,13.72 IC4.1
  Bottom 0.203: v13.77,29.57 12.95,28.75 11.99,28.75 v9.04,25.81 | v7.67,14.22 13.61,14.22 v13.66,14.28
OUT0
  Top 0.203: U$5.5 27.03,21.59 22.86,21.59 20.32,19.05 20.32,17.78 17.78,15.24 17.78,12.7 15.24,10.16 JP1.2
OUT1
  Top 0.203: 27.01,20.95 U$5.6 26.7,20.93 26.54,21.08 23.24,21.08 20.95,18.8 20.95,17.53 18.41,14.99 18.41,12.32 16.51,10.41 16.51,8.26 JP1.1
OUT2  (via drill 0.38)
  Top 0.203: U$5.7 27.03,20.27 v25.65,20.27
  Bottom 0.203: v25.65,20.27 21.67,20.27 20.37,18.97 20.37,17.78 17.91,15.32 17.91,15.24 17.8,15.14 17.8,12.68 16.51,11.38 16.51,5.69 15.27,4.45 JP2.2
OUT3
  Top 0.203: U$5.8 26.97,19.56 22.48,19.56 21.46,18.54 21.46,17.14 18.92,14.61 18.92,11.94 17.78,10.79 JP1.4
OUT4
  Top 0.203: U$5.9 26.97,19.05 22.61,19.05 21.97,18.41 21.97,16.76 19.43,14.22 19.43,11.56 19.05,11.18 19.05,8.26 JP1.3
OUT5  (via drill 0.38)
  Top 0.203: U$5.10 27.03,18.34 v25.63,18.34
  Bottom 0.203: v25.63,18.34 25.6,18.36 21.51,18.36 21.01,17.86 21.01,16.99 19.05,15.04 19.05,5.79 17.78,4.52 JP2.4
OUT6
  Top 0.203: U$5.11 26.96,17.6 22.96,17.6 22.55,17.2 22.55,16.2 20.32,13.97 JP1.6
OUT7
  Top 0.203: U$5.12 26.97,17.09 23.32,17.09 23.09,16.87 23.09,15.93 21.59,14.43 21.59,8.26 JP1.5
OUT8  (via drill 0.38)
  Top 0.203: U$5.13 v25.6,16.38
  Bottom 0.203: v25.6,16.38 22.86,16.38 21.59,15.11 21.59,5.59 20.45,4.45 JP2.6
OUT9
  Top 0.203: JP1.8 22.86,15.01 23.5,15.65 26.49,15.65 26.57,15.73 U$5.14 27.01,15.7
OUT10
  Top 0.203: JP1.7 24.13,8.26 24.13,14.73 24.51,15.16 27,15.16 U$5.15
OUT11  (via drill 0.38)
  Top 0.203: U$5.16 27.01,14.45 v25.58,14.45
  Bottom 0.203: v25.58,14.45 24.13,13.01 24.13,5.71 JP2.8
OUT12
  Top 0.203: JP1.10 25.4,13.34 25.53,13.46 33.78,13.46 34.75,14.43 U$5.17
OUT13
  Top 0.203: JP1.9 26.67,8.26 26.67,12.95 33.91,12.95 34.8,13.84 35.81,13.84 35.94,13.97 35.94,14.86 35.72,15.08 U$5.18
OUT14  (via drill 0.38)
  Top 0.203: v36.32,15.62 36.21,15.73 U$5.19
  Bottom 0.203: JP2.10 26.67,5.71 26.67,12.45 27.3,13.08 35.18,13.08 36.32,14.22 v36.32,15.62
OUT15
  Top 0.203: JP1.12 27.94,12.45 34.04,12.45 34.92,13.34 36.2,13.34 37.08,14.22 37.08,16.13 36.83,16.38 U$5.20
OUT16
  Top 0.203: JP1.11 29.21,8.26 29.21,11.68 29.46,11.94 34.29,11.94 35.18,12.83 36.45,12.83 37.59,13.97 37.59,16.76 37.49,16.87 35.51,16.87 35.35,17.03 U$5.21
OUT17  (via drill 0.38)
  Top 0.203: v36.58,17.65 36.55,17.68 U$5.22
  Bottom 0.203: JP2.12 29.21,5.71 29.21,12.06 29.72,12.57 35.43,12.57 37.21,14.35 37.21,16.89 36.58,17.53 v36.58,17.65
OUT18
  Top 0.203: JP1.14 30.61,9.65 30.61,11.3 30.73,11.43 34.54,11.43 35.43,12.32 36.7,12.32 38.1,13.72 38.1,18.16 37.82,18.44 35.43,18.44 35.32,18.33 U$5.23
OUT19
  Top 0.203: JP1.13 31.75,8.26 31.75,10.92 34.8,10.92 35.69,11.81 36.96,11.81 38.61,13.46 38.61,18.67 38.3,18.98 U$5.24
OUT20  (via drill 0.38)
  Top 0.203: v36.58,19.68 36.52,19.63 U$5.25
  Bottom 0.203: JP2.14 31.75,5.71 31.75,11.94 35.69,11.94 37.85,14.1 37.85,19.18 37.34,19.68 v36.58,19.68
OUT21
  Top 0.203: JP1.16 33.91,10.41 35.05,10.41 35.94,11.3 37.21,11.3 39.12,13.21 39.12,18.92 37.62,20.42 35.64,20.42 35.49,20.28 U$5.26 35.37,20.28
OUT22
  Top 0.203: JP1.15 34.29,8.26 34.29,9.53 34.67,9.91 35.31,9.91 36.2,10.79 37.47,10.79 39.62,12.95 39.62,19.3 38.08,20.85 35.48,20.85 35.41,20.93 U$5.27
OUT23  (via drill 0.38)
  Top 0.203: v36.45,21.59 36.44,21.58 U$5.28
  Bottom 0.203: JP2.16 34.29,5.71 34.29,9.27 38.48,13.46 38.48,20.07 36.96,21.59 v36.45,21.59
Q7
  Top 0.203: IC1.1 11.43,26.77 12.19,27.53 12.19,34.14 13.97,35.92 IC2.9
RESET  (via drill 0.38)
  Top 0.203: v23.67,27.18 23.67,27.53 24.69,28.55 R9.1 | v16.1,26.87 15.34,27.64 15.34,28.19 IC1.29
  Bottom 0.203: v23.67,27.18 23.37,26.87 17.93,26.87 | v16.1,26.87 17.93,26.87 | ICSP.5 39.98,24.89 39.88,24.79 27.74,24.79 27.64,24.69 18.34,24.69 17.93,25.09 17.93,26.87
RS_485_A  (via drill 0.38)
  Top 0.203: v9.04,18.54 8.79,18.29 8.79,16.26 IC4.6
  Bottom 0.203: v9.04,18.54 8.43,19.15 3.96,19.15 JP6.1
RS_485_B  (via drill 0.38)
  Top 0.203: v8.38,14.94 8.38,14.99 IC4.7
  Bottom 0.203: v8.38,14.94 7.62,15.7 3.96,15.7 JP6.2
SCK  (via drill 0.38)
  Top 0.203: v24.99,22.35 24.99,22.86 27.03,22.86 U$5.3 | v21.39,21.95 20.57,21.13 IC1.17
  Bottom 0.203: v21.39,21.95 24.59,21.95 v24.99,22.35 43.64,22.35 43.64,25.35 43.03,25.96 42.22,25.96 41.6,26.57 40.64,26.57 39.78,27.43 ICSP.3
SCL  (via drill 0.38)
  Top 0.203: v12.9,30.28 14.63,30.28 15.95,28.96 15.95,28.4 16.1,28.25 IC1.28 | v9.04,31.6 3.96,36.68 JP5.2
  Bottom 0.203: v12.9,30.28 11.58,31.6 v9.04,31.6
SDA  (via drill 0.38)
  Top 0.203: v15.95,30.68 16.71,29.92 16.71,28.45 16.92,28.25 IC1.27 | v9.04,33.48 3.96,38.56 3.96,40.18 JP5.1
  Bottom 0.203: v15.95,30.68 13.16,33.48 v9.04,33.48
SH_CP  (via drill 0.38)
  Top 0.203: v19.91,30.68 20.98,29.62 20.98,25.96 20.02,25.96 IC1.23 | v17.07,31.34 16.61,31.8 16.61,36.17 16.51,36.27 IC2.11 | v27.99,33.43 27.99,36.22 IC3.11
  Bottom 0.203: v17.07,31.34 19.25,31.34 v19.91,30.68 19.96,30.73 25.3,30.73 v27.99,33.43
ST_CP  (via drill 0.38)
  Top 0.203: 17.78,34.59 17.78,28.3 17.73,28.25 IC1.26 | 17.78,34.59 IC2.12 | v28.8,34.59 28.8,35.76 IC3.12 | 17.78,34.59 v18.29,34.59
  Bottom 0.203: v28.8,34.59 28.55,34.85 18.54,34.85 v18.29,34.59
VCC  (via drill 0.38)
  Top 0.406: U$5.32 34.9,24.18 32.77,26.31 C2.1 31.6,26.47 29.44,28.63 | R3.2 C1.1 22.86,28.4 23.01,28.55 R9.2 23.11,28.75 23.11,29.57 | 23.11,29.57 24.33,29.57 C5.1 26.06,31.04 27.03,31.04 29.44,28.63 | 23.01,29.87 23.01,29.72 23.11,29.57 | 23.01,29.87 23.01,36.12 22.86,36.27 IC2.16 | RN4.4 39.42,42.57 RN4.3 39.42,41.3 RN4.2 39.42,40.03 RN4.1 39.42,38.66 RN3.4 39.42,38.46 39.42,37.39 RN3.3 39.42,37.19 39.42,36.12 RN3.2 39.42,35.92 39.42,34.7 RN3.1 39.27,34.54 39.27,33.88 | 35.53,34.72 36.37,33.88 39.27,33.88 | 35.53,34.72 35.15,35.1 35.15,35.56 IC3.16 | v39.37,33.12 39.37,33.73 39.27,33.88 | 29.44,28.63 35.53,34.72 | 10.21,13.41 10.21,13.72 IC4.8 | 10.21,13.11 10.21,13.41 | 10.21,13.11 10.21,10.36 9.14,9.3 C6.1 | IC1.6 11.43,22.71 10.36,22.71 10.36,19.41 11.73,18.03 11.73,14.48 10.36,13.11 10.21,13.11 | RN1.1 9.25,43.69 9.25,42.57 RN1.2 9.25,42.42 9.25,41.3 RN1.3 9.25,41.15 9.25,40.03 RN1.4 9.25,39.88 9.25,38.66 RN2.1 9.25,38.46 9.25,37.39 RN2.2 9.25,37.19 9.25,36.12 RN2.3 9.25,35.92 9.25,34.7 RN2.4 9.4,34.59 10.49,33.5 | R4.2 10.97,45.97 9.35,44.35 9.35,43.84 RN1.1 | v13.41,31.19 14.73,31.19 C4.1 | 10.49,33.5 v11.23,32.77 | VREG.5 7.06,46.02 9.14,43.94 9.14,43.89 RN1.1 | 10.36,26.62 10.36,33.38 10.49,33.5 | 10.36,26.62 10.36,24.33 IC1.4 | 10.21,13.41 6.86,13.41 6.86,24.79 8.69,26.62 10.36,26.62 | v22.3,29.87 23.01,29.87
  Bottom 0.406: v39.37,33.12 42.52,29.97 ICSP.2 | v11.23,32.77 11.84,32.77 v13.41,31.19 13.56,31.09 14.78,29.87 v22.3,29.87
XLAT  (via drill 0.38)
  Top 0.203: v36.17,23.06 36.17,22.91 34.95,22.91 U$5.30 | v23.11,22.66 20.57,20.12 v19.51,20.12 | v16.31,20.98 16.15,20.83 16.15,19.66 IC1.13
  Bottom 0.203: v36.17,23.06 24.69,23.06 24.28,22.66 v23.11,22.66 | v19.51,20.12 18.64,20.98 v16.31,20.98

### Text on the board
tPlace: C | A | PROG | INPUT | C | M | 0 | 1 | 2 | 3 | 4 | 5 | 6 | 7 | SDA | SCL | 12V | GND | IREF | RGBIO8 v2 2011-08-28 | www.vonnieda.org | by Jason von Nieda | IREF | A | B | 0 | 1 | 2 | 3 | 4 | 5 | 6 | 7 | R | G | B | OUTPUT | A